# Altium schematic sheet Sheet1.SchDoc
size A3; SheetNumber: 1; SheetTotal: 1
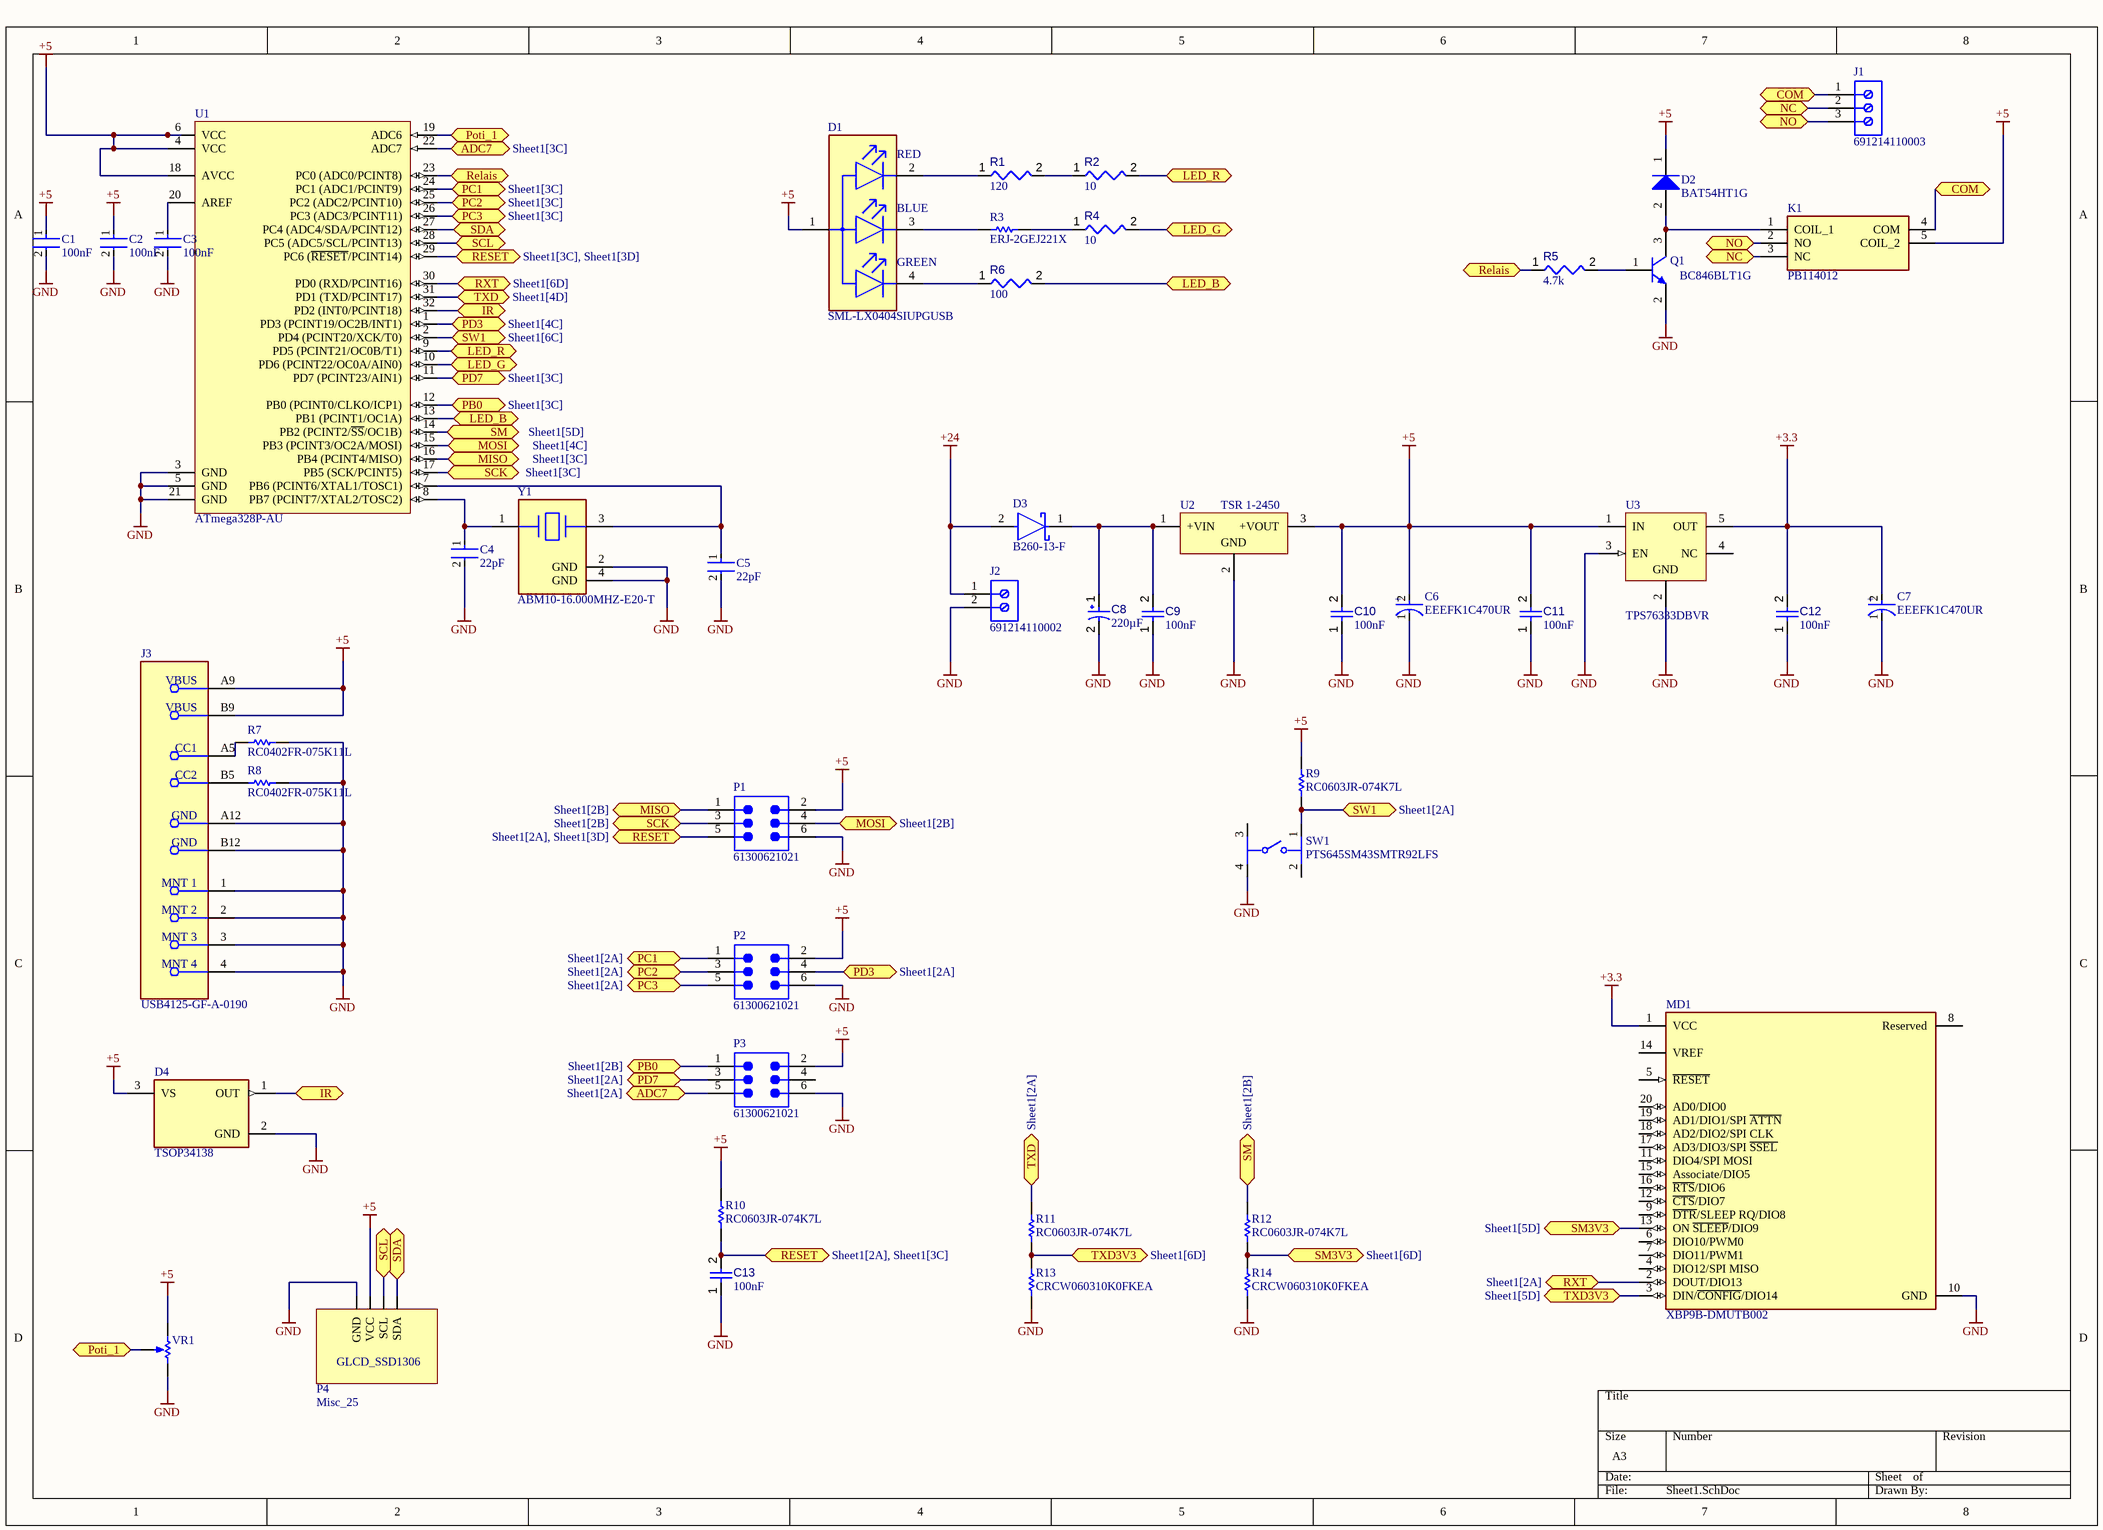
[diagram p0: Sheet1.SchDoc]

## Parts
C1  100nF  [FP-C0805C-DN-MFG]
C2  100nF  [FP-C0805C-DN-MFG]
C3  100nF  [FP-C0805C-DN-MFG]
C4  22pF  [FP-C0805C-DN-MFG]
C5  22pF  [FP-C0805C-DN-MFG]
C6  EEEFK1C470UR  [FP-FKC-MFG]
C7  EEEFK1C470UR  [FP-FKC-MFG]
C8  value 220µF  [CAPPR65-500-1250X1000X1350]  (hidden comment: ECA-1HM221)
C9  value 100nF  [CAPC0402(1005)60_L]  (hidden comment: Capacitor 100nF +/-20% 10V 0402)
C10  value 100nF  [CAPC0402(1005)60_L]  (hidden comment: Capacitor 100nF +/-20% 10V 0402)
C11  value 100nF  [CAPC0402(1005)60_L]  (hidden comment: Capacitor 100nF +/-20% 10V 0402)
C12  value 100nF  [CAPC0402(1005)60_L]  (hidden comment: Capacitor 100nF +/-20% 10V 0402)
C13  value 100nF  [CAPC0402(1005)60_L]  (hidden comment: Capacitor 100nF +/-20% 10V 0402)
D1  SML-LX0404SIUPGUSB  [FP-SML-LX0404SIUPGUSB-MFG]
D2  BAT54HT1G  [ONSC-SOD-323-2-477-02_V]
D3  B260-13-F  [FP-SMB-MFG]
D4  TSOP34138  [FP-6_550-5169_01-4-MFG]
J1  691214110003  [691214110003]
J2  691214110002  [691214110002]
J3  USB4125-GF-A-0190  [FP-USB4125-GF-A-0190-MFG]
K1  PB114012  [PB134005]
MD1  XBP9B-DMUTB002  [FP-XBP9B-DMUTB002-MFG]
P1  61300621021  [61300621021]
P2  61300621021  [61300621021]
P3  61300621021  [61300621021]
P4  Misc_25  [GLCD_SSD1306]
Q1  BC846BLT1G  [ONSC-SOT-23-3-318-08_V]
R1  value 120  [RESC0603(1608)_L]  (hidden comment: Resistor 120R +/-5 % 0603 0.1 W)
R2  value 10  [RESC0402(1005)_L]  (hidden comment: Resistor 10R  +/-1 % 0402 63 mW)
R3  ERJ-2GEJ221X  [RESC1005X40X25LL05T05]
R4  value 10  [RESC0402(1005)_L]  (hidden comment: Resistor 10R  +/-1 % 0402 63 mW)
R5  value 4.7k  [RESC2013X70X40ML20T20]  (hidden comment: Resistor 4k7 +/-1% 0805 125 mW)
R6  value 100  [RESC0402(1005)_L]  (hidden comment: Resistor 100R +/-1 % 0402 63 mW)
R7  RC0402FR-075K11L  [RESC1005X40X25LL05T10]
R8  RC0402FR-075K11L  [RESC1005X40X25LL05T10]
R9  RC0603JR-074K7L  [RESC1608X55X25ML10T15]
R10  RC0603JR-074K7L  [RESC1608X55X25ML10T15]
R11  RC0603JR-074K7L  [RESC1608X55X25ML10T15]
R12  RC0603JR-074K7L  [RESC1608X55X25ML10T15]
R13  CRCW060310K0FKEA  [RESC1609X50X30NL8T20]
R14  CRCW060310K0FKEA  [RESC1609X50X30NL8T20]
SW1  PTS645SM43SMTR92LFS  [FP-PTS645SM43SMTR92LFS-MFG]
U1  ATmega328P-AU  [32A_M]
U2  TSR 1-2450  [TRACO-SIP-3_V]
U3  TPS76333DBVR  [DBV0005A_N]
VR1  3362P-1-103LF  [BOUR-3362P]  (value not drawn)
Y1  ABM10-16.000MHZ-E20-T  [FP-ABM10-MFG]

## Ports
ADC7 (bidir, see Sheet1[2A]), ADC7 (bidir, see Sheet1[3C]), COM (bidir, see Sheet1[7A]), COM (bidir, see Sheet1[8A]), IR (bidir, see Sheet1[2A]), IR (bidir, see Sheet1[2C]), LED_B (bidir, see Sheet1[2B]), LED_B (bidir, see Sheet1[5A]), LED_G (bidir, see Sheet1[2A]), LED_G (bidir, see Sheet1[5A]), LED_R (bidir, see Sheet1[2A]), LED_R (bidir, see Sheet1[5A]), MISO (bidir, see Sheet1[2B]), MISO (bidir, see Sheet1[3C]), MOSI (bidir, see Sheet1[2B]), MOSI (bidir, see Sheet1[4C]), NC (bidir, see Sheet1[7A]), NO (bidir, see Sheet1[7A]), PB0 (bidir, see Sheet1[2B]), PB0 (bidir, see Sheet1[3C]), PC1 (bidir, see Sheet1[2A]), PC1 (bidir, see Sheet1[3C]), PC2 (bidir, see Sheet1[2A]), PC2 (bidir, see Sheet1[3C]), PC3 (bidir, see Sheet1[2A]), PC3 (bidir, see Sheet1[3C]), PD3 (bidir, see Sheet1[2A]), PD3 (bidir, see Sheet1[4C]), PD7 (bidir, see Sheet1[2A]), PD7 (bidir, see Sheet1[3C]), Poti_1 (bidir, see Sheet1[1D]), Poti_1 (bidir, see Sheet1[2A]), Relais (bidir, see Sheet1[2A]), Relais (bidir, see Sheet1[6A]), RESET (bidir, see Sheet1[2A], Sheet1[3C]), RESET (bidir, see Sheet1[2A], Sheet1[3D]), RESET (bidir, see Sheet1[3C], Sheet1[3D]), RXT (bidir, see Sheet1[2A]), RXT (bidir, see Sheet1[6D]), SCK (bidir, see Sheet1[2B]), SCK (bidir, see Sheet1[3C]), SCL (bidir, see Sheet1[2A]), SCL (bidir, see Sheet1[2D]), SDA (bidir, see Sheet1[2A]), SDA (bidir, see Sheet1[2D]), SM3V3 (bidir, see Sheet1[5D]), SM3V3 (bidir, see Sheet1[6D]), SM (bidir, see Sheet1[2B]), SM (bidir, see Sheet1[5D]), SW1 (bidir, see Sheet1[2A]), SW1 (bidir, see Sheet1[6C]), TXD3V3 (bidir, see Sheet1[5D]), TXD3V3 (bidir, see Sheet1[6D]), TXD (bidir, see Sheet1[2A]), TXD (bidir, see Sheet1[4D])

## Nets
+3.3: C7.2(A) C12.2 MD1.1(VCC) U3.5(OUT)
+5: C1.1 C2.1 C6.2(A) C10.2 C11.2 D1.1(Common_Anode) D2.1(K) D4.3(VS) J3.A9(VBUS) J3.B9(VBUS) K1.5(COIL_2) P1.2 P2.2 P3.2 P4.2(VCC) R9.2 R10.2 U1.4(VCC) U1.6(VCC) U1.18(AVCC) U2.3(+VOUT) U3.1(IN) VR1.1(CCW)
+24: D3.2(A) J2.1
GND: C1.2 C2.2 C3.2 C4.2 C5.2 C6.1(C) C7.1(C) C8.2 C9.1 C10.1 C11.1 C12.1 C13.1 D4.2(GND) J2.2 J3.1(MNT_1) J3.2(MNT_2) J3.3(MNT_3) J3.4(MNT_4) J3.A12(GND) J3.B12(GND) MD1.10(GND) P1.6 P2.6 P3.6 P4.1(GND) Q1.2(E) R7.2 R8.2 R13.1 R14.1 SW1.4 U1.3(GND) U1.5(GND) U1.21(GND) U2.2(GND) U3.2(GND) U3.3(EN) VR1.3(CW) Y1.2(GND) Y1.4(GND)
ADC7: P3.5 U1.22(ADC7) ; port ADC7
COM: J1.1 K1.4(COM) ; port COM
IR: D4.1(OUT) U1.32(PD2_(INT0/PCINT18)) ; port IR
LED_B: R6.2 U1.13(PB1_(PCINT1/OC1A)) ; port LED_B
LED_G: R4.2 U1.10(PD6_(PCINT22/OC0A/AIN0)) ; port LED_G
LED_R: R2.2 U1.9(PD5_(PCINT21/OC0B/T1)) ; port LED_R
MISO: P1.1 U1.16(PB4_(PCINT4/MISO)) ; port MISO
MOSI: P1.4 U1.15(PB3_(PCINT3/OC2A/MOSI)) ; port MOSI
NC: J1.2 K1.3(NC) ; port NC
NO: J1.3 K1.2(NO) ; port NO
PB0: P3.1 U1.12(PB0_(PCINT0/CLKO/ICP1)) ; port PB0
PC1: P2.1 U1.24(PC1_(ADC1/PCINT9)) ; port PC1
PC2: P2.3 U1.25(PC2_(ADC2/PCINT10)) ; port PC2
PC3: P2.5 U1.26(PC3_(ADC3/PCINT11)) ; port PC3
PD3: P2.4 U1.1(PD3_(PCINT19/OC2B/INT1)) ; port PD3
PD7: P3.3 U1.11(PD7_(PCINT23/AIN1)) ; port PD7
Poti_1: U1.19(ADC6) VR1.2(S) ; port Poti_1
Relais: R5.1 U1.23(PC0_(ADC0/PCINT8)) ; port Relais
RESET: C13.2 P1.5 R10.1 U1.29(PC6_(~{RESET}/PCINT14)) ; port RESET
RXT: MD1.2(DOUT/DIO13) U1.30(PD0_(RXD/PCINT16)) ; port RXT
SCK: P1.3 U1.17(PB5_(SCK/PCINT5)) ; port SCK
SCL: P4.3(SCL) U1.28(PC5_(ADC5/SCL/PCINT13)) ; port SCL
SDA: P4.4(SDA) U1.27(PC4_(ADC4/SDA/PCINT12)) ; port SDA
SM: R12.2 U1.14(PB2_(PCINT2/~{SS}/OC1B)) ; port SM
SM3V3: MD1.13(ON_~{SLEEP}/DIO9) R12.1 R14.2 ; port SM3V3
SW1: R9.1 SW1.1 U1.2(PD4_(PCINT20/XCK/T0)) ; port SW1
TXD: R11.2 U1.31(PD1_(TXD/PCINT17)) ; port TXD
TXD3V3: MD1.3(DIN/~{CONFIG}/DIO14) R11.1 R13.2 ; port TXD3V3
NetC3_1: C3.1 U1.20(AREF)
NetC4_1: C4.1 U1.8(PB7_(PCINT7/XTAL2/TOSC2)) Y1.1
NetC5_1: C5.1 U1.7(PB6_(PCINT6/XTAL1/TOSC1)) Y1.3
NetC8_1: C8.1 C9.2 D3.1(C) U2.1(+VIN)
NetD1_2: D1.2(Red_C) R1.1
NetD1_3: D1.3(Blue_C) R3.1
NetD1_4: D1.4(Green_C) R6.1
NetD2_2: D2.2(A) K1.1(COIL_1) Q1.3(C)
NetJ3_A5: J3.A5(CC1) R7.1
NetJ3_B5: J3.B5(CC2) R8.1
NetQ1_1: Q1.1(B) R5.2
NetR1_2: R1.2 R2.1
NetR3_2: R3.2 R4.1

Not connected (* = marked no-connect by the designer): MD1 4(DIO12/SPI_MISO) 5(~{RESET}) 6(DIO10/PWM0) 7(DIO11/PWM1) 8(Reserved) 9(~{DTR}/SLEEP_RQ/DIO8) 11(DIO4/SPI_MOSI) 12(~{CTS}/DIO7) 14(VREF) 15(Associate/DIO5) 16(~{RTS}/DIO6) 17(AD3/DIO3/SPI_~{SSEL}) 18(AD2/DIO2/SPI_CLK) 19(AD1/DIO1/SPI_~{ATTN}) 20(AD0/DIO0); P3 4; SW1 2 3; U3 4(NC)

## Notes on the sheet
- (near D1) RED
- (near D1) BLUE
- (near D1) GREEN
- (in symbol CMP-021-000017-1) GLCD_SSD1306
- (in symbol CMP-05427-002132-1) +

## Library data of the parts
C1-C3 = CMP-2007-00279-2: CAP CER 0.1UF 50V X7R 0805; Manufacturer Part Number: C0805C104K5RACTU; Manufacturer: KEMET; Value: 0.10 μF; Tolerance: 0.1; Temperature Coefficient: 30ppm/°C; Material: Ceramic; Device Class L2: Capacitors; Temperature Range Low: -55°C; Voltage Rating: 50 V; Digikey Description: CAP CER 0.1UF 50V X7R 0805; Category: Cap; ComponentLink2Description: Datasheet; Octopart: https://octopart.com/c0805c104k5ractu-kemet-143926; RoHS: TRUE; ComponentLink2URL: https://content.kemet.com/datasheets/KEM_C1003_C0G_SMD.pdf; Temperature Characteristic: X7R; Temperature: -55°C to +125°C; Height: 0.88mm; Temperature Range High: +125°C; Device Class L1: Passive Components; Automotive: No; Lead Free: Yes; Ipc Land Pattern Name: CAPC200125X78; Device Class L3: Ceramic Capacitors; Mouser Description: Cap Ceramic 0.1uF 50V X7R 10% SMD 2.0 x 1.2 mm 125 C Paper T/R; Capacitance: 0.10 μF; Package: C0805C-DN
C4 C5 = CMP-2007-00048-2: Capacitor; Ceramic; Cap; 22.0pF; Tol 5%; SMT; Vol-Rtg 50V; C0G; Tape and Reel; Manufacturer: KEMET; Manufacturer Part Number: C0805C220J5GACTU; Temperature Coefficient: 30ppm/°C; Tolerance: 0.05; Device Class L1: Passive Components; Mouser Description: Multilayer Ceramic Capacitors MLCC - SMD/SMT 50volts 22pF C0G 5%; Temperature Range Low: -55°C; Automotive: No; Voltage Rating: 50 V; Material: Ceramic; Category: Cap; Height: 0.88mm; Temperature Range High: +125°C; Capacitance: 22 pF; Digikey Description: Capacitor; Ceramic; Cap; 22.0pF; Tol 5%; SMT; Vol-Rtg 50V; C0G; Tape and Reel; Octopart: https://octopart.com/c0805c220j5gactu-kemet-145470; ComponentLink2Description: Datasheet; Device Class L2: Capacitors; Ipc Land Pattern Name: CAPC200125X78; Value: 22 pF; RoHS: TRUE; ComponentLink2URL: https://content.kemet.com/datasheets/KEM_C1003_C0G_SMD.pdf; Temperature: -55°C to +125°C; Device Class L3: Ceramic Capacitors; Lead Free: Yes; Temperature Characteristic: C0G; Package: C0805C-DN
C6 C7 = CMP-05427-002132-1: CAP ALUM 47UF 20% 16V SMD; Dielectric Material: Aluminium; ESR (Equivalent Series Resistance): 700mR; Ripple Current: 160mA; Life (Hours): 2000Hour; Leakage Current: 3uA; Voltage: 10V; Length: 5.8mm; Voltage Rating: 16V; Ratings: AEC-Q200; Package Quantity: 1000; Min Operating Temperature: -55°C; Mount: Surface Mount; Width: 6.5mm; Voltage Rating (DC): 16V; Radiation Hardening: No; Diameter: 5mm; RoHS Compliant: Yes; Reach SVHC Compliant: Yes; Termination: SMD/SMT; Material: Aluminium; Ripple Current (AC): 160mA; Impedance: 700mR; Series: FK; Height - Seated (Max): 0.228inch; Packaging: Tape and Reel; Height: 5.8mm; Capacitance: 47uF; Contact Plating: Tin; Construction: Cylindrical; Number of Pins: 2; Lead Free: Lead Free; Tolerance: 20%; Max Operating Temperature: 105°C; Case/Package: Radial
C8 = CMP-001-00028-7: Aluminum Electrolytic Capacitor, 220 uF, +/- 20%, 50 V, -40 to 85 degC, 2-Pin THD, RoHS, Bulk; Manufacturer: Panasonic; Ripple Current (AC): 400mA; Voltage Rating: 50V; Case/Package: Radial; Packaging: Bulk; Package Quantity: 200; Min Operating Temperature: -40°C; Datasheet Version: Mar-16; Package Reference: CAPPR65-500-1250X1000X1350; Mounting Technology: TH; Ripple Current: 400mA; Pins: 2; Package Description: 2-Pin Radial Lead, Dia 10 mm, Body Length 12.5 mm; RoHS Compliant: True; Max Operating Temperature: 85°C; Lead Pitch: 5mm; Tolerance: 20%; Manufacturer URL: http://www.panasonic.com/; Diameter: 10mm; Capacitor Type: Electrolytic; Datasheet URL: http://industrial.panasonic.com/cdbs/www-data/pdf/RDF0000/DMF0000COL68.pdf
C9-C13 = CMP-001-00061-3: Chip Capacitor, 100nF +/-20%, 10V, 0402, Thickness 0.6 mm; Tolerance: 20%; Mounting Technology: SMT; Voltage Rating: 10V; Max Operating Temperature: 85°C; Pins: 2; Case/Package: 0402; Min Operating Temperature: -55°C
D1 = CMP-2000-07119-2: LED RGB CLEAR SMD; Test Current: 2mA; Wavelength: 465nm; Color: Blue; Lens Style: Square; Power Rating: 30mW; Lens Color: Colorless; Number of LEDs: 3; Viewing Angle: 120°; Luminous Intensity: 20mcd; Forward Voltage: 2.73V; Height: 0.3mm; Lead Free: Lead Free; Max Operating Temperature: 85°C; Mount: Surface Mount; REACH SVHC: No SVHC; Case Code (Imperial): 0404; Forward Current: 2mA; Case Code (Metric): 1010; Lens Transparency: Clear; Length: 1mm; Packaging: Tape and Reel; Min Operating Temperature: -40°C; Package Quantity: 2000; Case/Package: 0404; Width: 1mm
D2 = CMP-1055-00462-1: Schottky Barrier Diode, 2-Pin SOD-323, Pb-Free, Tape and Reel; Manufacturer: On Semiconductor; Configuration: Single; trr Max (ns): 5; IFSM Max (A): 0.6; ComponentLink3URL: http://www.onsemi.com/pub_link/Collateral/477-02.PDF.1; PackageDescription: 2-Pin SOD, Body 1.7 x 1.25 mm; ComponentLink2URL: http://www.onsemi.cn/pub_link/Collateral/BAT54HT1-D.PDF; ComponentLink3Description: Package Specification; ComponentLink2Description: Datasheet; DatasheetVersion: Rev. 6; PackageReference: SOD-323-2-477-02; RoHS: TRUE; ComponentLink1URL: http://www.onsemi.com/; Packing: Tape and Reel; PartNumber: BAT54HT1G; Mounting Technology: Surface Mount; ComponentLink1Description: Manufacturer URL; PackageVersion: Rev. H, 03/2007
D3 = CMP-12790-000014-1: DIODE SCHOTTKY 60V 2A SMB; Manufacturer: Diodes Inc.; Max Surge Forward Current: 50A; Value: 200pF; Max Junction Temp: +150°C; Standoff Height: 0.05mm; Peak Reverse Current: 0.5mA; Device Class L1: Discrete Semiconductors; Temperature Range High: +150°C; Device Class L3: Schottky Diodes; ComponentLink2Description: Datasheet; Height: 2.5mm; Automotive: No; ComponentLink2URL: https://www.diodes.com/assets/Datasheets/ds13004.pdf; Temperature: -65°C to +150°C; Mouser Description: Schottky Diodes & Rectifiers 60V 2A; Temperature Range Low: -65°C; Capacitance: 200pF; Device Class L2: Diodes; Forward Current: 2A; Lead Free: Yes; Manufacturer Part Number: B260-13-F; Octopart: https://octopart.com/b260-13-f-diodes+inc.-325789; Max Repetitive Reverse Voltage: 60V; Reverse Voltage: 60V; Package: SMB; Footprint Url: https://www.diodes.com/assets/Package-Files/SMB.pdf; Digikey Description: DIODE SCHOTTKY 60V 2A SMB; Category: Diode; RoHS: TRUE
D4 = CMP-02532-000001-1: SENSOR REMOTE REC 38.0KHZ 45M; Manufacturer: Vishay; Sensing Distance: 30m; Max Junction Temp: +100°C; Max Supply Voltage: 5.5V; Sensor Output: Other; Standoff Height: 2.5mm; Output Current: 5mA; Min Supply Voltage: 2.5V; Operating Supply Current: 3mA; Device Class L1: Sensors; Package: 6.550-5169.01-4; Device Class L3: Photoelectric Sensors; Temperature Range High: +85°C; Category: Diode; Digikey Description: SENSOR REMOTE REC 38.0KHZ 45M; Lead Free: Yes; Octopart: https://octopart.com/tsop34138-vishay-55433998; Ambient Temperature Range Low: -25°C; Ambient Temperature Range High: +85°C; Height: 10.85mm; Manufacturer Part Number: TSOP34138; ComponentLink2URL: http://www.vishay.com/docs/82490/tsop321.pdf; Device Class L2: Optical Sensors; Mouser Description: 38 kHz 45 m 2.5-5.5 V Through Hole IR Receiver Module for Remote Control System; RoHS: TRUE; Temperature: -25°C to +85°C; Automotive: No; Temperature Range Low: -25°C; ComponentLink2Description: Datasheet
J1 = CMP-1502-02466-2: NexarPartId: 18818289; Number of Levels: 1; Voltage: 300V; Pitch: 3.5052mm; Stripping Length: -6mm; Number of Positions Per Level: 3; Plating: Brass, Steel; Wire/Cable Gauge: 24AWG; Wire Gauge (Min): 16AWG; Current Rating: 10A; Width: 10.9mm; Length: 7.4mm; Housing Material: Nylon; Height: 12.2mm; Min Operating Temperature: -40°C; Contact Plating: Brass, Tin; Packaging: Box; Color: Blue, Green; Number of Contacts: 3; Number of Pins: 3; Voltage Rating: 300V; Termination: Screw; Lead Pitch: 3.5mm; Max Operating Temperature: 105°C; Mount: Through Hole; Contact Material: Brass; RoHS: Compliant; Wire Gauge (Max): 24AWG; Current: 10A; REACH SVHC: Unknown
J2 = CMP-1502-02464-2: NexarPartId: 18818288; Plating: Brass, Steel; Current: 10A; Pitch: 3.5052mm; Number of Levels: 1; Number of Contacts: 2; Wire Gauge (Min): 16AWG; Voltage: 300V; Wire Gauge (Max): 24AWG; Stripping Length: -6mm; Number of Pins: 2; Number of Rows: 1; REACH SVHC: Unknown; RoHS: Compliant; Housing Material: Nylon; Termination: Screw; Mount: Through Hole; Contact Plating: Brass, Tin; Number of Positions Per Level: 2; Color: Blue, Green; Width: 7.9mm; Voltage Rating: 300V; Length: 7.4mm; Current Rating: 10A; Wire/Cable Gauge: 24AWG; Packaging: Box; Max Operating Temperature: 105°C; Lead Pitch: 3.5mm; Height: 8.7mm; Contact Material: Brass; Min Operating Temperature: -40°C
J3 = CMP-245163-000004-1: CONN RCPT TYPE C 6P SMD RA
K1 = PB114012: Relay or Contactor; Manufacturer_Name: TE Connectivity; Datasheet Link: https://www.te.com/commerce/DocumentDelivery/DDEController?Action=srchrtrv&DocNm=PB&DocType=Data%20Sheet&DocLang=English&PartCntxt=8-1415029-1&DocFormat=pdf; Height: 20mm; Manufacturer_Part_Number: PB114012; Mouser Part Number: 655-PB114012; Mouser Price/Stock: https://www.mouser.co.uk/ProductDetail/TE-Connectivity-PB/PB114012?qs=h4sDRd%2FXttgmnfmiBw0NHA%3D%3D; Arrow Part Number: PB114012; Arrow Price/Stock: https://www.arrow.com/en/products/pb114012/te-connectivity?region=nac
MD1 = CMP-84319-000004-1: RX TXRX MOD ISM < 1GHZ U.FL TH; Max Supply Voltage: 3.6V; Current - Transmitting: 215mA; Sensitivity: -101dBm; Min Frequency: 902MHz; Memory Size: 2KB; Max Frequency: 928MHz; Min Supply Voltage: 2.4V; Current - Receiving: 29mA; Interface: SPI; Data Rate: 200Kbps; Frequency: 900MHz; Output Power (dBm): 24dBm; Number of Pins: 20; Series: XBee-Pro™; Max Operating Temperature: 85°C; Radiation Hardening: No; Min Operating Temperature: -40°C; Package Quantity: 1; RAM Size: 2KB; Packaging: Bulk; Case/Package: Module
P1-P3 = CMP-1502-01071-4: NexarPartId: 32855528; Contact Resistance: 20mΩ; Current Rating: 3A; Operating Supply Voltage: 250V; Row Spacing: 2.54mm; Connector Type: Male Pin; Gender: Male; Number of Contacts: 6; Contact Mating Length: 5.9944mm; Number of Rows: 2; REACH SVHC: Unknown; RoHS: Compliant; Termination: Solder; Height: 5.23mm; Number of Pins: 6; Voltage Rating: 250V; Packaging: Bulk; Lead Pitch: 2.54mm; Mount: Through Hole; Max Operating Temperature: 105°C; Color: Black; Number of Positions: 6; Contact Material: Copper; Contact Plating: Gold; Min Operating Temperature: -40°C; Pitch: 2.54mm
P4 = CMP-021-000017-1: QR: 0; RS_number: 120 622; Design Item ID: Misc_25; Source: Miscellaneous$.SchLib; mounting: THT; Pin Count: 4; Component Type: Standard; UID: Misc_25
Q1 = CMP-1048-00779-1: General Purpose Transistor, NPN Silicon, 3-Pin SOT-23, Pb-Free, Tape and Reel; Manufacturer: On Semiconductor; fT Min (MHz): 100; IC Continuous (A): 0.1; Mounting Technology: Surface Mount; ComponentLink1Description: Manufacturer URL; ComponentLink2Description: Datasheet; Polarity: NPN; ComponentLink3URL: http://www.onsemi.cn/pub_link/Collateral/318-08.PDF; DatasheetVersion: Rev. 11; ComponentLink3Description: Package Specification; PartNumber: BC846BLT1G; RoHS: TRUE; PackageDescription: 3-Pin Small Outline Transistor, Body 2.92 x 1.3 mm, Pitch 0.95 mm; PackageReference: SOT-23-3-318-08; ComponentLink2URL: http://www.onsemi.cn/pub_link/Collateral/BC846ALT1-D.PDF; PackageVersion: Rev. AP, 11/2009; ComponentLink1URL: http://www.onsemi.com/; Packing: Tape and Reel
R1 = CMP-009-00176-3: Chip Resistor, 120 Ohms, +/-5 %, 0.1 W, -55 to 155 degC, 0603; Power: 100mW; Tolerance: 5%; Max Operating Temperature: 155°C; Pins: 2; Case/Package: 0603; Min Operating Temperature: -55°C
R2 R4 = CMP-009-00152-3: Chip Resistor, 10 Ohms, +/-1 %, 63 mW, -55 to 155 degC, 0402; Tolerance: 1%; Power: 63mW; Pins: 2; Max Operating Temperature: 155°C; Min Operating Temperature: -55°C; Case/Package: 0402
R3 = CMP-2002-00487-3: Chip Resistor, 220 Ohm, +/- 5%, 100 mW, -55 to 155 degC, 0402 (1005 Metric), RoHS, Tape and Reel; Manufacturer: Basic Passives; Voltage Rating: 50 V; Case\/Package: 0402; Power Rating: 100 mW; Resistance: 220 Ohm; Mounting Technology: Surface Mount; Width: 0.5 mm; Package Quantity: 10000; REACH SVHC: Unknown; Height: 0.35 mm; PackageReference: 0402; PackageDescription: 2-Pin Surface Mount Device, Body 1 x 0.5 mm; PartNumber: ERJ-2GEJ221X; Length: 1 mm; Max Operating Temperature: 155 degC; Tolerance: 5%; ComponentLink1Description: Manufacturer URL; Pins: 2; ComponentLink1URL: http://www.panasonic.com/; Min Operating Temperature: -55 degC; Case Code (Imperial): 0402; Mount: Surface Mount; Case Code (Metric): 1005; ComponentLink2URL: http://industrial.panasonic.com/cdbs/www-data/pdf/RDA0000/AOA0000C84.pdf; Packaging: Tape and Reel; ComponentLink2Description: Datasheet; DatasheetVersion: 04/2015; Radiation Hardening: No; RoHSCompliant: true
R5 = CMP-009-00032-5: Chip Resistor, 4.7 KOhm, +/- 1%, 0.125 W, -55 to 155 degC, 0805 (2012 Metric); Power: 125mW; Voltage Rating: 150V; Max Operating Temperature: 155°C; Min Operating Temperature: -55°C; Case/Package: 0805; RoHS Compliant: True; Pins: 2; Tolerance: 1%; Mounting Technology: SM
R6 = CMP-009-00167-3: Chip Resistor, 100 Ohms, +/-1 %, 63 mW, -55 to 155 degC, 0402; Power: 63mW; Tolerance: 1%; Min Operating Temperature: -55°C; Case/Package: 0402; Pins: 2; Max Operating Temperature: 155°C
R7 R8 = CMP-2002-07752-1: Manufacturer: Yageo / Phycomp; Part Number: RC0402FR-075K11L
R9-R12 = CMP-2000-05024-1: Chip Resistor, 4.7 KOhm, +/- 5%, 100 mW, -55 to 155 degC, 0603 (1608 Metric), RoHS, Tape and Reel; Manufacturer: Yageo; Resistance: 4.7kOhms; Temperature Coefficient: 100PPM/C; Power Rating: 100mW; Voltage Rating: 50V; Operating Temperature Range: -55Cto+155C; Case Code - mm: 1608; Tolerance: 5%; Product: ThickFilmResistorsGeneralPurpose; Case Code - in: 0603; Datasheet URL: http://www.yageo.com/documents/recent/PYu-RC_Group_51_RoHS_L_04.pdf; Package Reference: 603; Datasheet Version: Rev. 4, 02/2016; Package Description: 2-Pin Surface Mount Device, Body 1.6 x 0.8 mm; Manufacturer URL: http://www.yageo.com/; Series: RC; Packaging: Reel; Termination Style: SMD/SMT
R13 R14 = CMP-1666-00005-4: Chip Resistor, 10 KOhm, +/- 1%, 100 mW, -55 to 155 degC, 0603 (1608 Metric), RoHS, Tape and Reel; Manufacturer: Vishay Semiconductor; Voltage Rating: 75 V; Max Operating Temperature: 155 degC; PackageDescription: 2-Pin Surface Mount Device, Body 1.575 x 0.85 mm; ComponentLink1Description: Manufacturer URL; RoHSCompliant: true; PackageReference: 0603; REACH SVHC: Unknown; Length: 1.55 mm; DatasheetVersion: 06/2012; Packaging: Tape and Reel; Min Operating Temperature: -55 degC; Mounting Technology: Surface Mount; ComponentLink2URL: https://datasheet.ciiva.com/11809/0900766b80d98afc-11809037.pdf; Height: 0.45 mm; ComponentLink2Description: Datasheet; Package Quantity: 5000; ComponentLink1URL: http://www.vishay.com/
SW1 = CMP-2000-05160-2: SWITCH TACTILE SPST-NO 0.05A 12V; Contact Resistance: 100mR; Throw Configuration: SPST; Illumination Type: Non-Illuminated; Mechanical Life: 100000Cycles; Current Rating: 50mA; Switch Function: Off-Mom; Actuator Length: 0.85mm; Actuator Material: Nylon; Actuator Type: Standard; Operating Force: 160gf; Min Operating Temperature: -20°C; REACH SVHC: No SVHC; Termination: Gull Wing; Case/Package: SMD/SMT; Packaging: Tape and Reel; Mount: Surface Mount; Voltage Rating (DC): 12V; Orientation: Straight; Lead Free: Lead Free; Contact Material: Silver; Color: Black; Max Current Rating: 50mA; Contact Plating: Silver; Depth: 9mm; Package Quantity: 1; Max Voltage Rating (DC): 12V; Length: 6mm; Max Operating Temperature: 60°C
U1 = CMP-0095-00269-2: 8-bit AVR Microcontroller, 32KB Flash, 1KB EEPROM, 2KB SRAM, 32-pin TQFP, Industrial Grade (-40°C to 85°C); PackageDescription: 32-Lead, 7x7x1.0 mm Body, 0.8mm Lead Pitch, Thin Profile Plastic Quad Flat Package (TQFP); DatasheetVersion: revD, May-2011; RevisionNote: DatasheetVersion & PackageVersion updated. URLs added.; ComponentLink1URL: http://www.atmel.com/; ComponentLink2Description: ATmega48A/48PA/88A/88PA/168A/168PA/328/328P Datasheet; Code_JEDEC: MS-026-ABA; ComponentLink1Description: Manufacturer URL; PackageReference: 32A; ComponentLink3Description: ATmega48A/48PA/88A/88PA/168A/168PA/328/328P Summary; ComponentLink2URL: http://www.atmel.com/dyn/resources/prod_documents/doc8271.pdf; PackageVersion: revC, Oct-2010; ComponentLink3URL: http://www.atmel.com/dyn/resources/prod_documents/8271S.pdf
U2 = CMP-2000-05427-1: DC/DC converter, 5 VDC, 1000 mA, -40 to 85 degC, 3-Pin SIP, RoHS; Manufacturer: Tracopower; Output Voltage Nom.: 5V; Output Current Max: 1A; Product Range: TSR-1Series; DC / DC Converter Mounting: ThroughHole; Output Power Max: 5W; No. of Outputs: 1Output; Input Voltage DC Max: 36V; Approvals & Standards: IEC,UL; Input Voltage DC Min: 6.5V; DC / DC Converter Output Type: Fixed; Depth: 11.7mm; Package Reference: SIP-3; DC / DC Converter Type: SIP; Height: 10.2mm; Width: 7.6mm; Package Description: 3-Pin Single In-line Package, Body 11.7 x 7.6 mm, Pitch 2.54 mm; Manufacturer URL: http://www.tracopower.com/home; Datasheet Version: Jan-15; Datasheet URL: https://datasheet.ciiva.com/6815/tsr1-6815641.pdf
U3 = CMP-0394-00569-2: Single Output LDO, 150 mA, Fixed 3.3 V Output, 2.7 to 10 V Input, with Low IQ, 5-pin SOT-23 (DBV), -40 to 125 degC, Green (RoHS & no Sb/Br); Manufacturer: Texas Instruments; Vout Adj(Min)(V): 3.3; SubFamily: Single Channel LDO; Iout(Max)(A): 0.15; Vdo(Typ)(mV): 300; Accuracy(%): 3; Vin(Max)(V): 10; Vin(Min)(V): 2.7; Iq(Typ)(mA): 0.08; ComponentLink2Description: Datasheet; ComponentLink1Description: Manufacturer URL; ComponentLink3URL: http://www.ti.com/litv/pdf/mpds018i; PackageReference: DBV0005A; ComponentLink3Description: Package Specification; DatasheetVersion: SLVS181H; PartNumber: TPS76333DBVR; Eco-Plan: Green (RoHS & no Sb/Br); Code_JEDEC: MO-178; ComponentLink1URL: http://www.ti.com/; PackageDescription: 5-Pin Plastic Small Outline, Body 1.60 Ãƒâ€” 2.90 mm, Pitch 0.95 mm; Vout Adj(Max)(V): 3.3; Mounting Technology: Surface Mount; ComponentLink2URL: http://www.ti.com/general/docs/lit/getliterature.tsp?genericPartNumber=TPS76333&fileType=pdf; Fixed Output Options(V): 3.3; PackageVersion: 4073253-4/K
VR1 = CMP-009-00039-2: Square Trimpot(R) Trimming Potentiometer, 10 KOhm, 300 V, -55 to 125 degC, 3-Pin THD, RoHS, Tube; Manufacturer: Bourns; Tolerance: 10%; Power: 500mW; Voltage Rating: 300V; Resistance: 10k; Packaging: Rail/Tube; Package Reference: 3326P; Manufacturer URL: http://www.bourns.com/; Composition: Potentiometer; Package Description: 3-Pin Through Hole Device, Body 6.6 x 6.99 mm, Pitch 2.54 mm; Max Operating Temperature: 125°C; Min Operating Temperature: -55°C; Datasheet Version: May-16; Lead Pitch: 2.54mm; Pins: 3; Datasheet URL: http://www.bourns.com/docs/Product-Datasheets/3362.pdf; Package Quantity: 250; Case/Package: 3326P; RoHS Compliant: True; Mounting Technology: TH
Y1 = CMP-27762-001978-1: Crystal 16MHz ±20ppm 10pF SMD-4 2.5mm x 2mm; ESR (Equivalent Series Resistance): 150R; Mount: Surface Mount; Package Quantity: 1000; Frequency Tolerance: 20ppm; Operating Frequency: 16 MHz; Length: 2.5mm; Series: ABM10; Width: 0.079inch; Termination: SMD/SMT; Max Operating Temperature: 70°C; REACH SVHC: No SVHC; Tolerance: 20ppm; Series Resistance: 150R; Height: 0.02inch; Case/Package: CSMD; Load Capacitance: 10pF; Packaging: Tape and Reel; Frequency Stability: 20ppm; Number of Pins: 4; Depth: 2mm; Frequency: 16MHz; Min Operating Temperature: -20°C; Lead Free: Lead Free